# EAGLE schematic Anemometer (EAGLE 9.6.2)

## Sheet 1 of 4: microcontroller
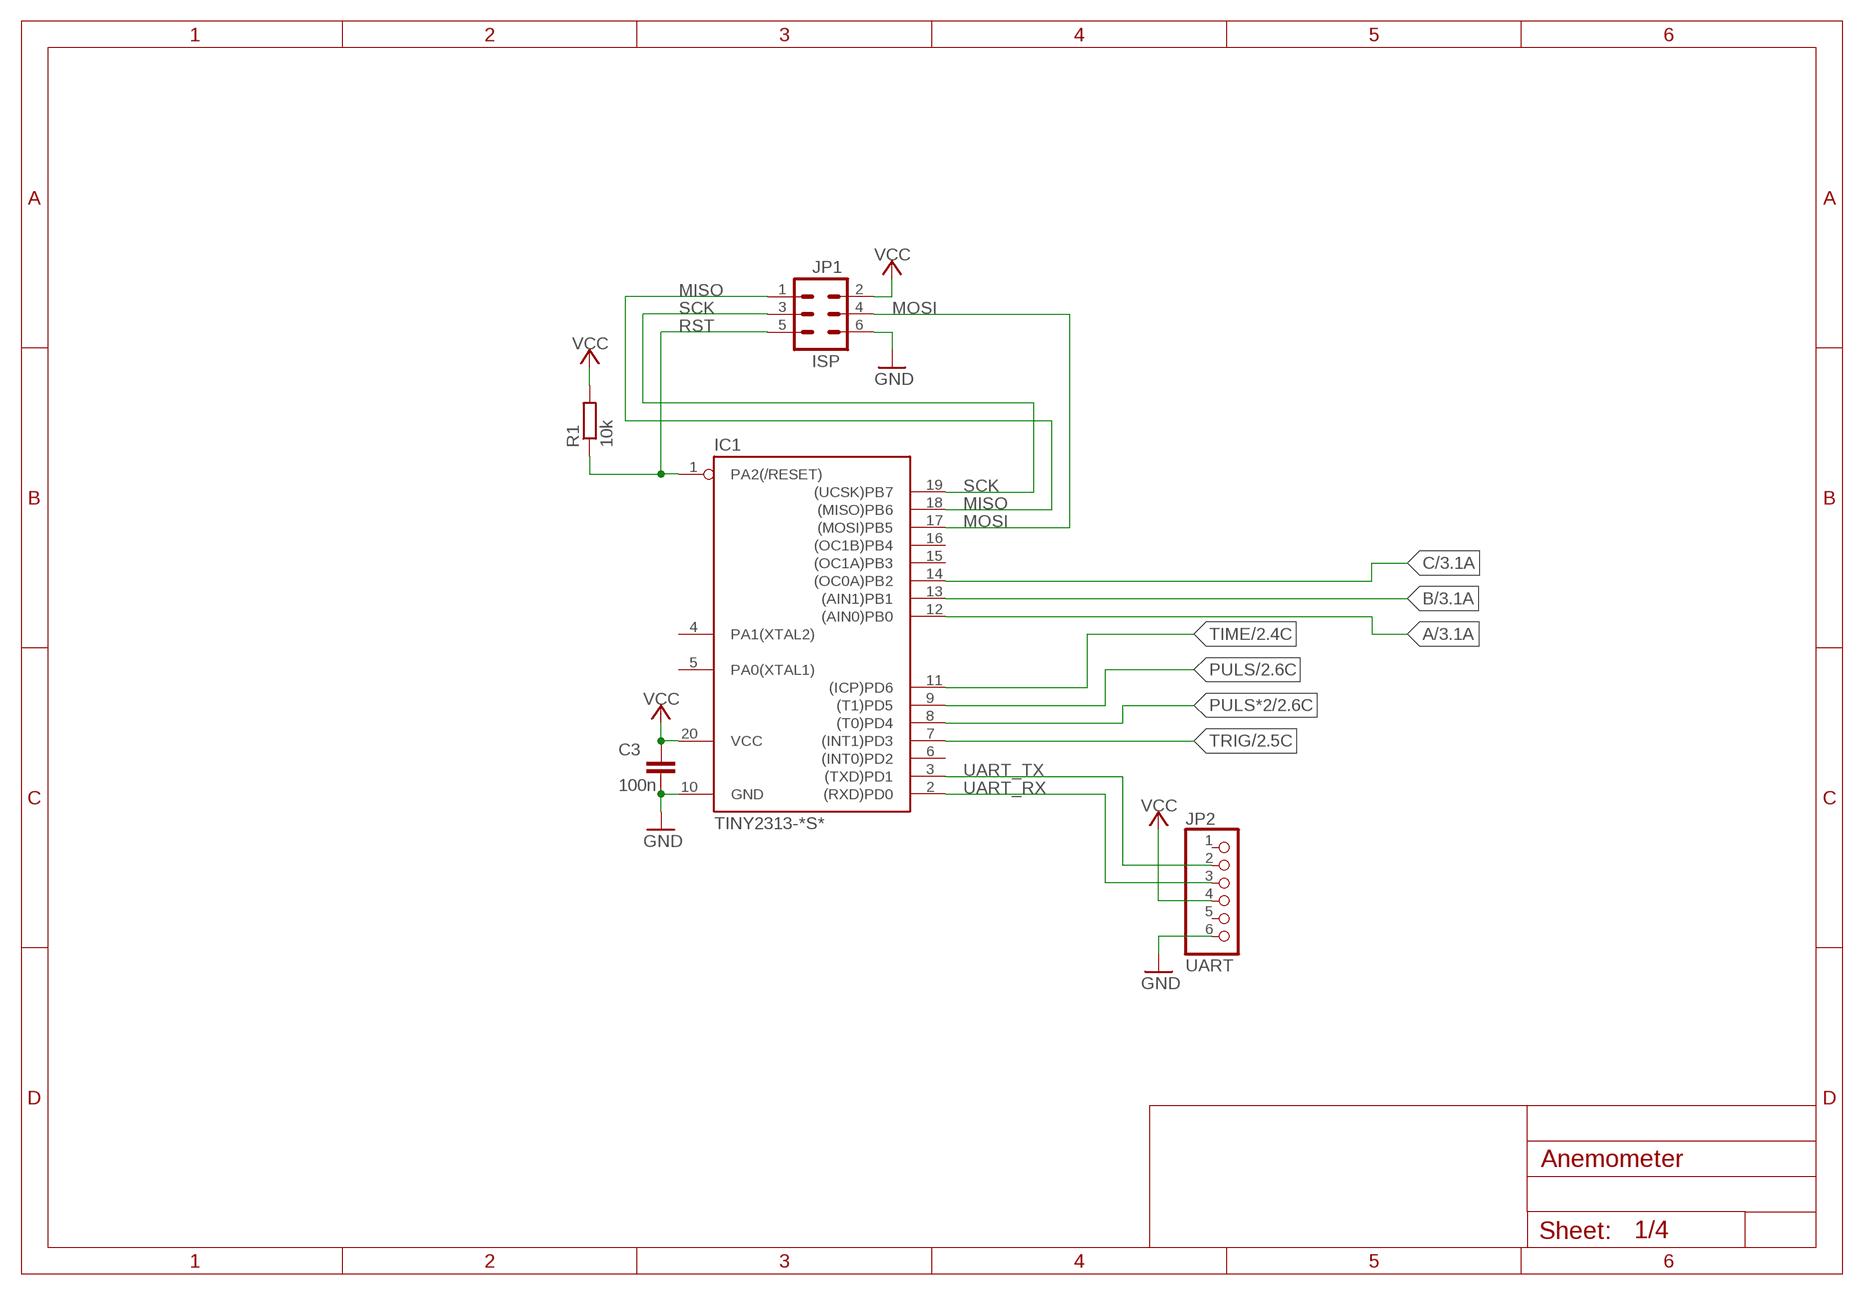
[diagram p0: schematic, sheet 1]

### Parts
C3  100n  C-EU050-024X044  [C050-024X044]
IC1  TINY2313-*S*  [SO20L$]
JP1  ISP  ML6  [ML6]
JP2  UART  PINHD-1X6  [1X06]
R1  10k  R-EU_0207/10  [0207/10]

### Nets
A: IC1.12((AIN0)PB0) ; also sheet 3
B: IC1.13((AIN1)PB1) ; also sheet 3
C: IC1.14((OC0A)PB2) ; also sheet 3
GND: C3.2 IC1.10(GND) JP1.6 JP2.6 ; also sheet 2,3,4
MISO: IC1.18((MISO)PB6) JP1.1
MOSI: IC1.17((MOSI)PB5) JP1.4
PULS: IC1.9((T1)PD5) ; also sheet 2
PULS*2: IC1.8((T0)PD4) ; also sheet 2
RST: IC1.1(PA2(/RESET)) JP1.5 R1.1
SCK: IC1.19((UCSK)PB7) JP1.3
TIME: IC1.11((ICP)PD6) ; also sheet 2
TRIG: IC1.7((INT1)PD3) ; also sheet 2,3
UART_RX: IC1.2((RXD)PD0) JP2.3
UART_TX: IC1.3((TXD)PD1) JP2.2
VCC: C3.1 IC1.20(VCC) JP1.2 JP2.4 R1.2 ; also sheet 2,3,4
Unconnected: IC1.4(PA1(XTAL2)) IC1.5(PA0(XTAL1)) IC1.6((INT0)PD2) IC1.15((OC1A)PB3) IC1.16((OC1B)PB4) JP2.1 JP2.5

## Sheet 2 of 4: puls generation
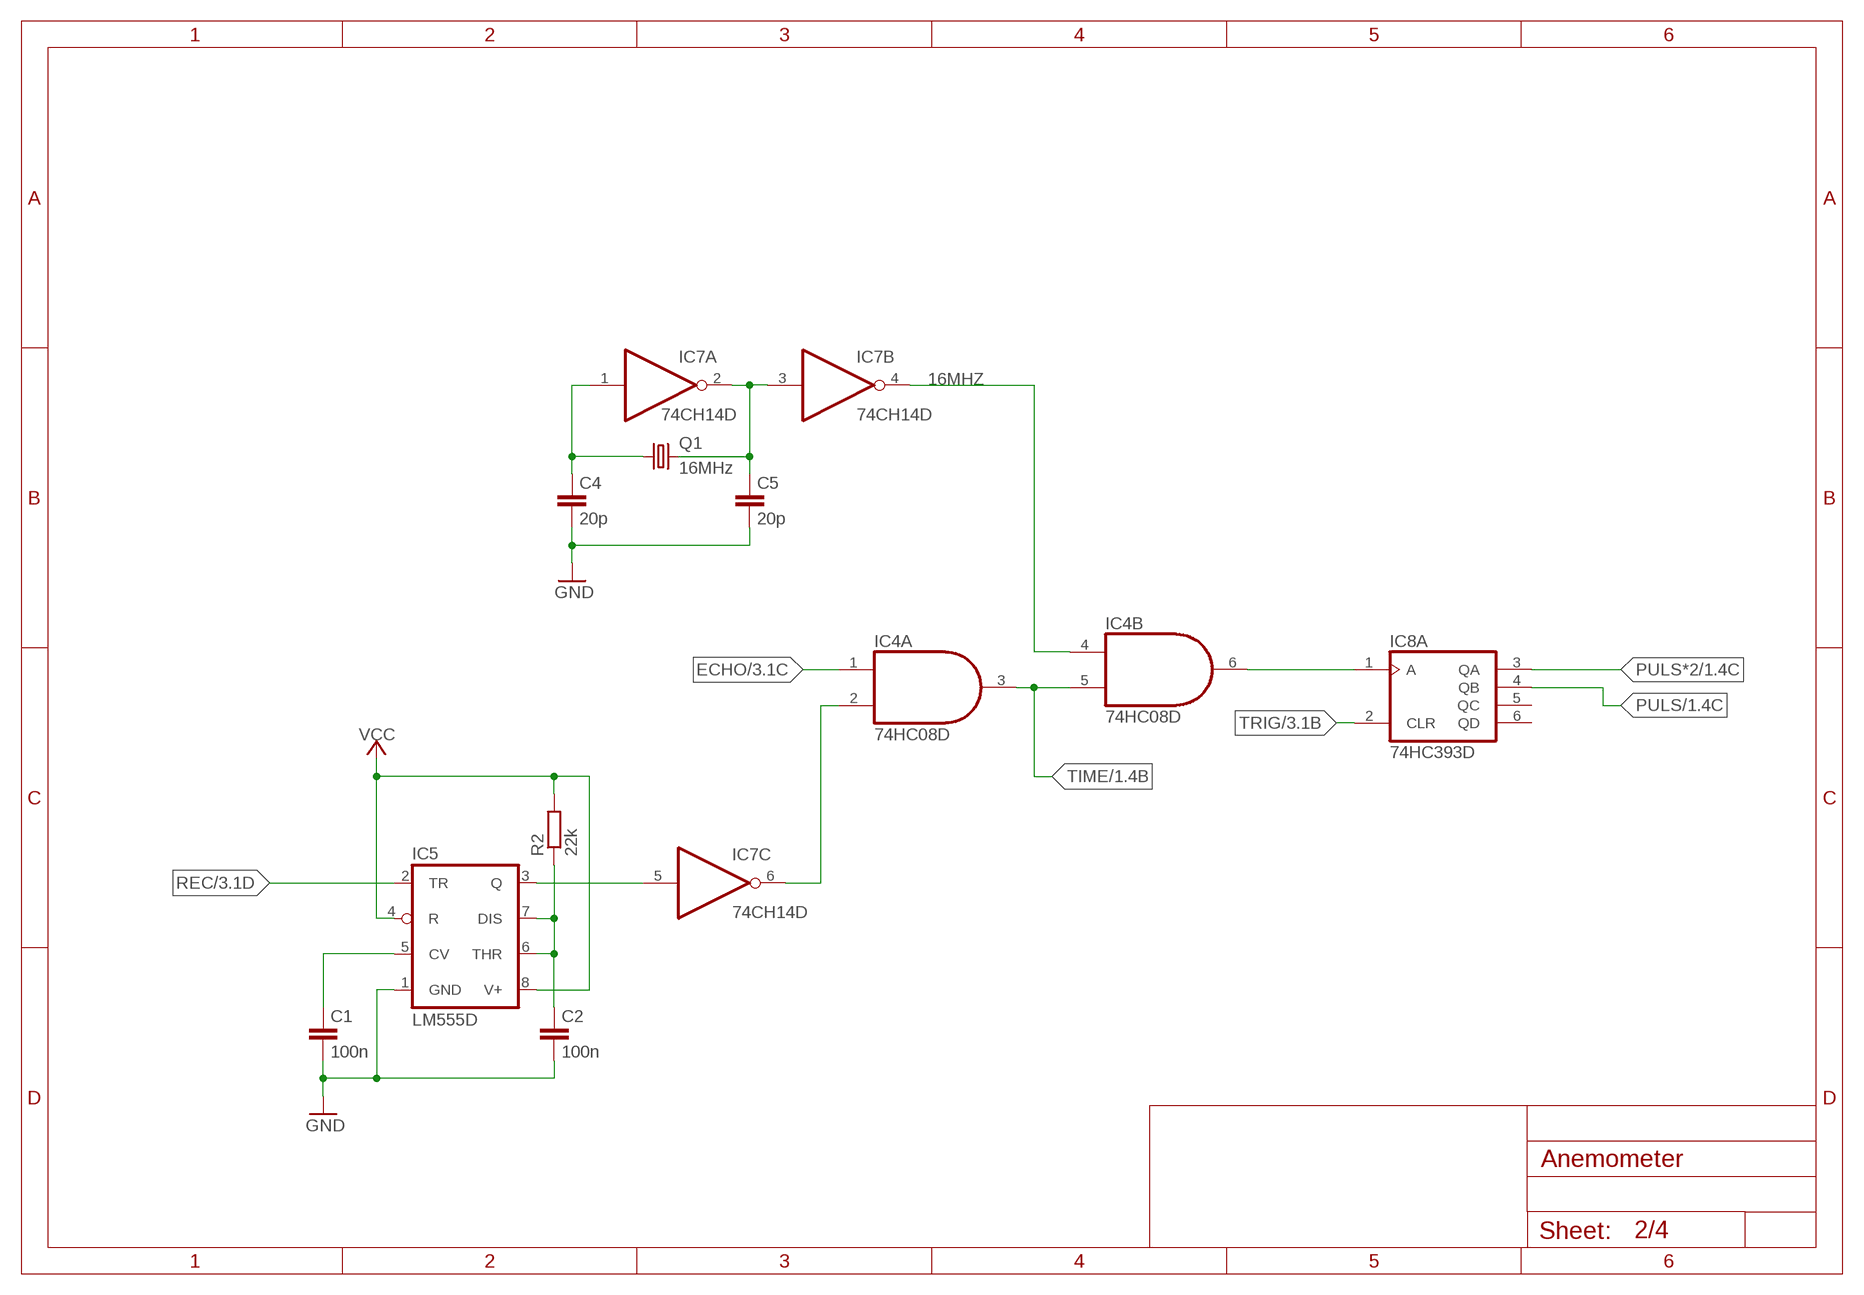
[diagram p1: schematic, sheet 2]

### Parts
C1  100n  C-EUC0805  [C0805]
C2  100n  C-EUC0805  [C0805]
C4  20p  C-EUC0805  [C0805]
C5  20p  C-EUC0805  [C0805]
IC4  74HC08D  74ALS08D  [SO14]
IC5  LM555D  [SO08]
IC7  74CH14D  74ALS04D  [SO14]
IC8  74HC393D  74LS393D  [SO14]
Q1  16MHz  CRYSTALHC49UP  [HC49UP]
R2  22k  R-EU_R0805  [R0805]

### Nets
16MHZ: IC4.4(B:I0) IC7.4(B:O)
ECHO: IC4.1(A:I0) ; also sheet 3
GND: C1.2 C2.2 C4.2 C5.2 IC5.1(GND) ; also sheet 1,3,4
N$1: IC5.3(Q) IC7.5(C:I)
N$2: C1.1 IC5.5(CV)
N$3: IC4.6(B:O) IC8.1(A:A)
N$4: C2.1 IC5.6(THR) IC5.7(DIS) R2.1
N$5: IC4.2(A:I1) IC7.6(C:O)
N$6: C4.1 IC7.1(A:I) Q1.1
N$7: C5.1 IC7.2(A:O) IC7.3(B:I) Q1.2
PULS: IC8.4(A:QB) ; also sheet 1
PULS*2: IC8.3(A:QA) ; also sheet 1
REC: IC5.2(TR) ; also sheet 3
TIME: IC4.3(A:O) IC4.5(B:I1) ; also sheet 1
TRIG: IC8.2(A:CLR) ; also sheet 1,3
VCC: IC5.4(R) IC5.8(V+) R2.2 ; also sheet 1,3,4
Unconnected: IC8.5(A:QC) IC8.6(A:QD)

## Sheet 3 of 4: multiplexer
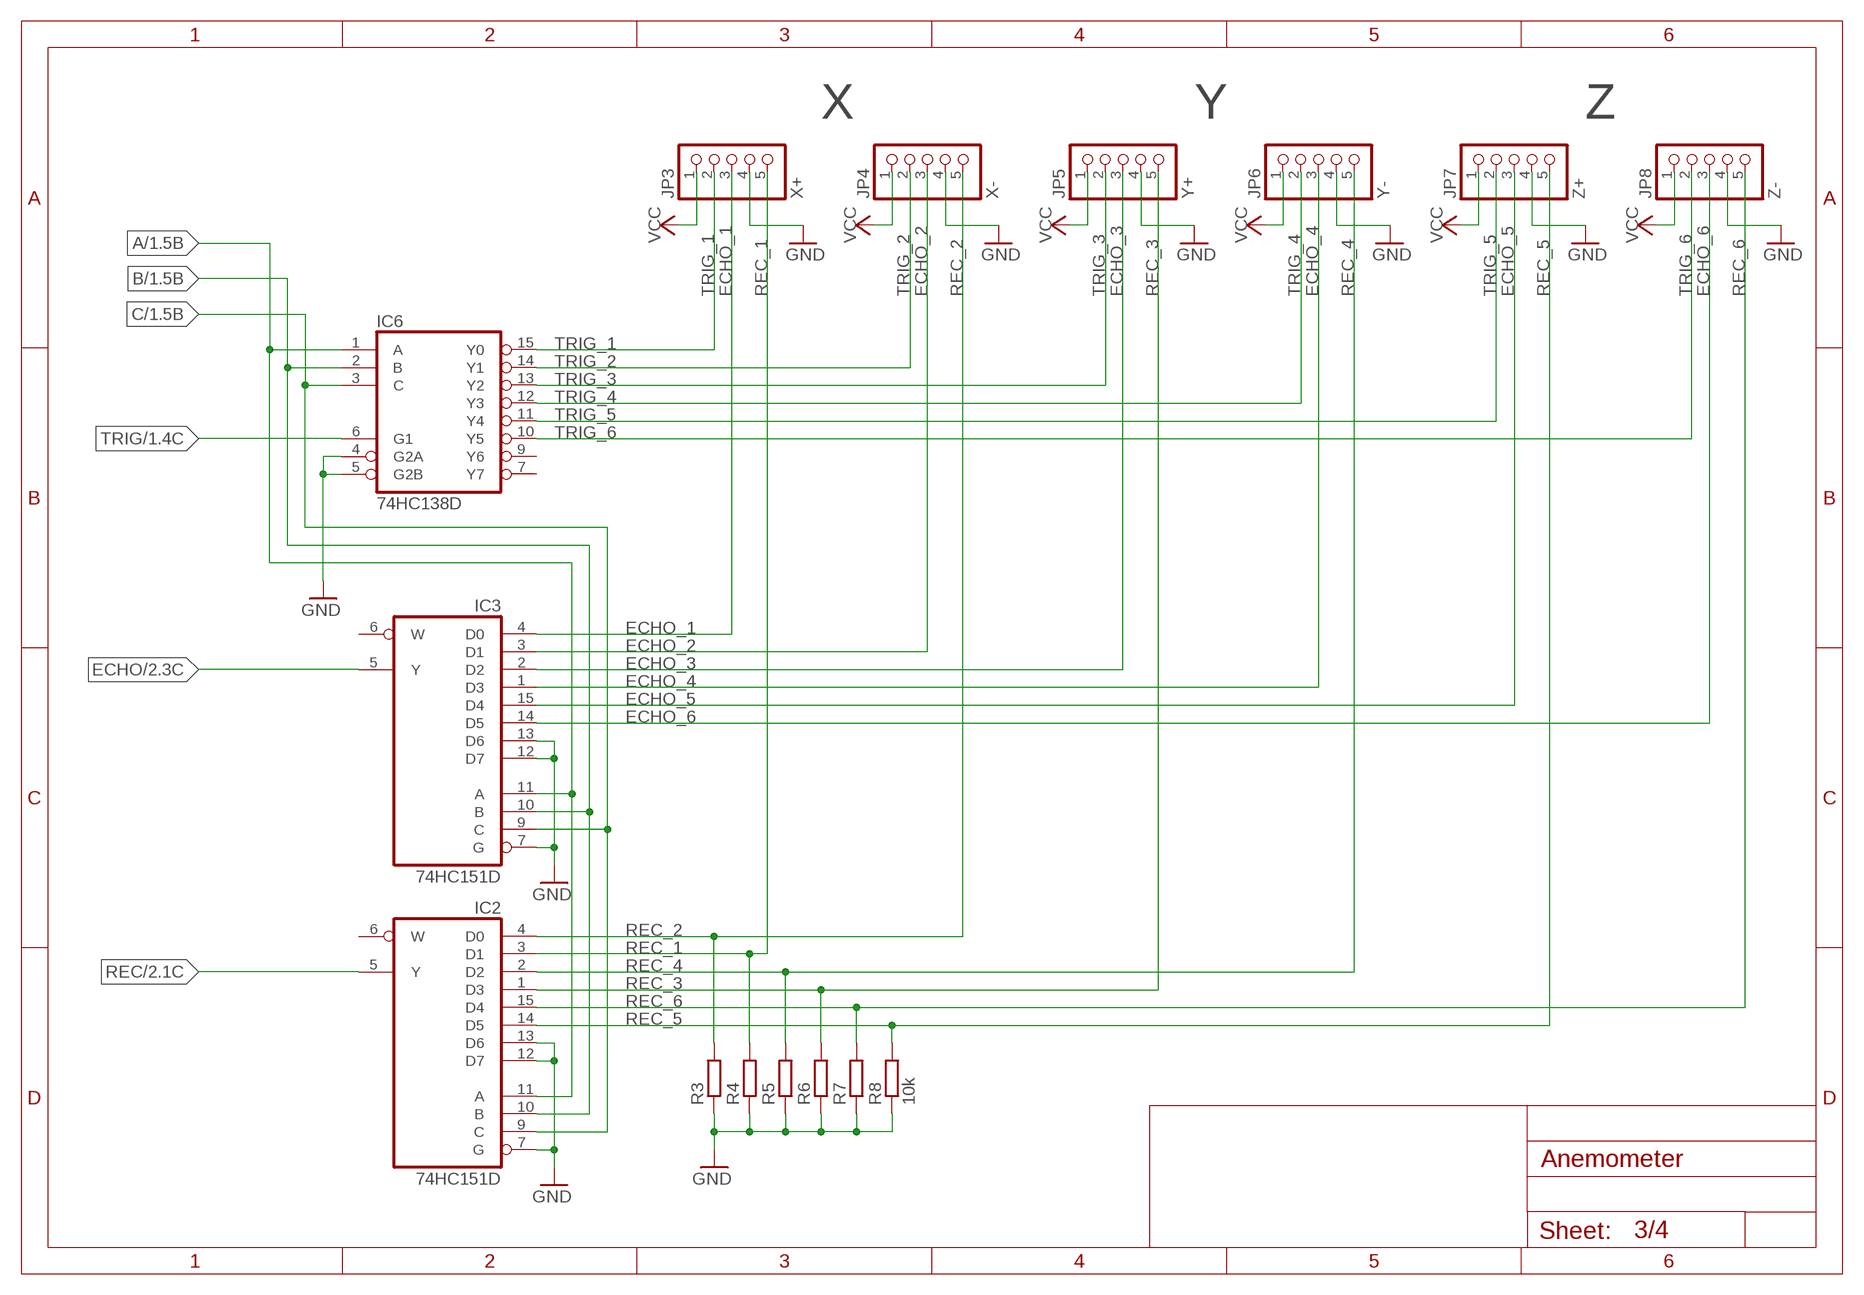
[diagram p2: schematic, sheet 3]

### Parts
IC2  74HC151D  74LS151D  [SO16]
IC3  74HC151D  74LS151D  [SO16]
IC6  74HC138D  74LS138D  [SO16]
JP3  X+  PINHD-1X5  [1X05]
JP4  X-  PINHD-1X5  [1X05]
JP5  Y+  PINHD-1X5  [1X05]
JP6  Y-  PINHD-1X5  [1X05]
JP7  Z+  PINHD-1X5  [1X05]
JP8  Z-  PINHD-1X5  [1X05]
R3  10k  R-EU_R0805  [R0805]
R4  10k  R-EU_R0805  [R0805]
R5  10k  R-EU_R0805  [R0805]
R6  10k  R-EU_R0805  [R0805]
R7  10k  R-EU_R0805  [R0805]
R8  10k  R-EU_R0805  [R0805]

### Nets
A: IC2.11(A) IC3.11(A) IC6.1(A) ; also sheet 1
B: IC2.10(B) IC3.10(B) IC6.2(B) ; also sheet 1
C: IC2.9(C) IC3.9(C) IC6.3(C) ; also sheet 1
ECHO: IC3.5(Y) ; also sheet 2
ECHO_1: IC3.4(D0) JP3.3
ECHO_2: IC3.3(D1) JP4.3
ECHO_3: IC3.2(D2) JP5.3
ECHO_4: IC3.1(D3) JP6.3
ECHO_5: IC3.15(D4) JP7.3
ECHO_6: IC3.14(D5) JP8.3
GND: IC2.7(G) IC2.12(D7) IC2.13(D6) IC3.7(G) IC3.12(D7) IC3.13(D6) IC6.4(G2A) IC6.5(G2B) JP3.4 JP4.4 JP5.4 JP6.4 JP7.4 JP8.4 R3.1 R4.1 R5.1 R6.1 R7.1 R8.1 ; also sheet 1,2,4
REC: IC2.5(Y) ; also sheet 2
REC_1: IC2.3(D1) JP3.5 R4.2
REC_2: IC2.4(D0) JP4.5 R3.2
REC_3: IC2.1(D3) JP5.5 R6.2
REC_4: IC2.2(D2) JP6.5 R5.2
REC_5: IC2.14(D5) JP7.5 R8.2
REC_6: IC2.15(D4) JP8.5 R7.2
TRIG: IC6.6(G1) ; also sheet 1,2
TRIG_1: IC6.15(Y0) JP3.2
TRIG_2: IC6.14(Y1) JP4.2
TRIG_3: IC6.13(Y2) JP5.2
TRIG_4: IC6.12(Y3) JP6.2
TRIG_5: IC6.11(Y4) JP7.2
TRIG_6: IC6.10(Y5) JP8.2
VCC: JP3.1 JP4.1 JP5.1 JP6.1 JP7.1 JP8.1 ; also sheet 1,2,4
Unconnected: IC2.6(W) IC3.6(W) IC6.7(Y7) IC6.9(Y6)

### Notes on the sheet
- X | Y | Z

## Sheet 4 of 4: power / unused gates
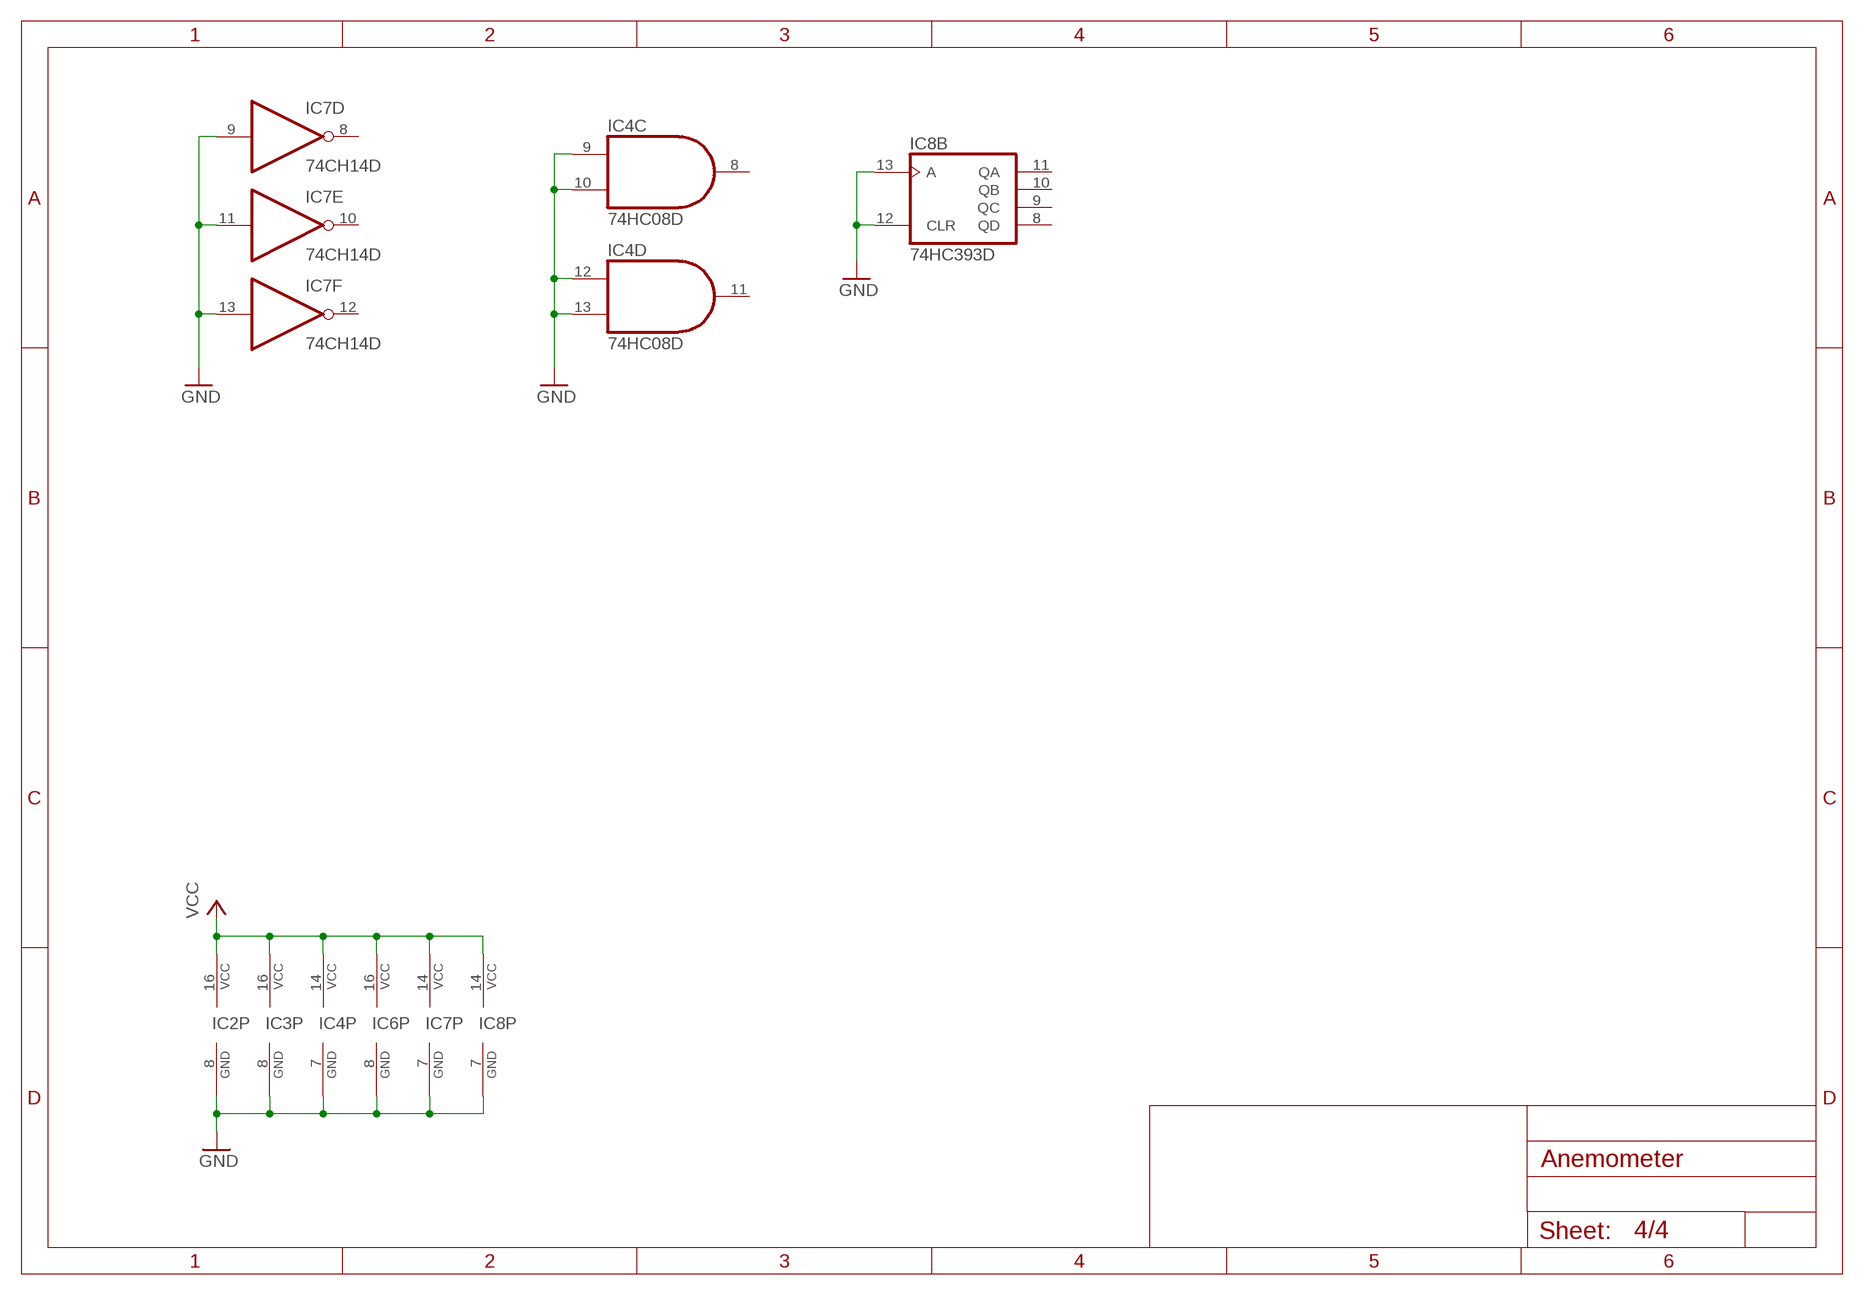
[diagram p3: schematic, sheet 4]

### Nets
GND: IC2.8(GND) IC3.8(GND) IC4.7(P:GND) IC4.9(C:I0) IC4.10(C:I1) IC4.12(D:I0) IC4.13(D:I1) IC6.8(GND) IC7.7(P:GND) IC7.9(D:I) IC7.11(E:I) IC7.13(F:I) IC8.7(P:GND) IC8.12(B:CLR) IC8.13(B:A) ; also sheet 1,2,3
VCC: IC2.16(VCC) IC3.16(VCC) IC4.14(P:VCC) IC6.16(VCC) IC7.14(P:VCC) IC8.14(P:VCC) ; also sheet 1,2,3
Unconnected: IC4.8(C:O) IC4.11(D:O) IC7.8(D:O) IC7.10(E:O) IC7.12(F:O) IC8.8(B:QD) IC8.9(B:QC) IC8.10(B:QB) IC8.11(B:QA)

## Library data of the parts
C1-C5 = rcl:C-EU: CAPACITOR, European symbol; SPICEPREFIX: C
IC1 = avr-7:TINY2313*: Atmel Tiny2313 2K Flash, 128 bytes EEPROM, 128 bytes RAM
IC2 IC3 = 74xx-us:74*151: Data SELECTOR/MULTIPLEXER
IC4 = 74xx-us:74*08: Quad 2-input AND gate
IC5 = linear:*555: TIMER
IC6 = 74xx-us:74*138: 3-line to 8-line DECODER/DEMULTIPLEXER
IC7 = 74xx-us:74*04: Hex INVERTER
IC8 = 74xx-us:74*393: Dual 4-bit decade and binary COUNTER
JP1 = con-harting-ml:ML6: HARTING; OC_FARNELL: unknown; OC_NEWARK: unknown
JP2 = pinhead:PINHD-1X6: PIN HEADER
JP3-JP8 = pinhead:PINHD-1X5: PIN HEADER
Q1 = crystal:CRYSTAL: CRYSTAL; OC_FARNELL: unknown; OC_NEWARK: unknown
R1-R8 = rcl:R-EU_: RESISTOR, European symbol; SPICEPREFIX: R